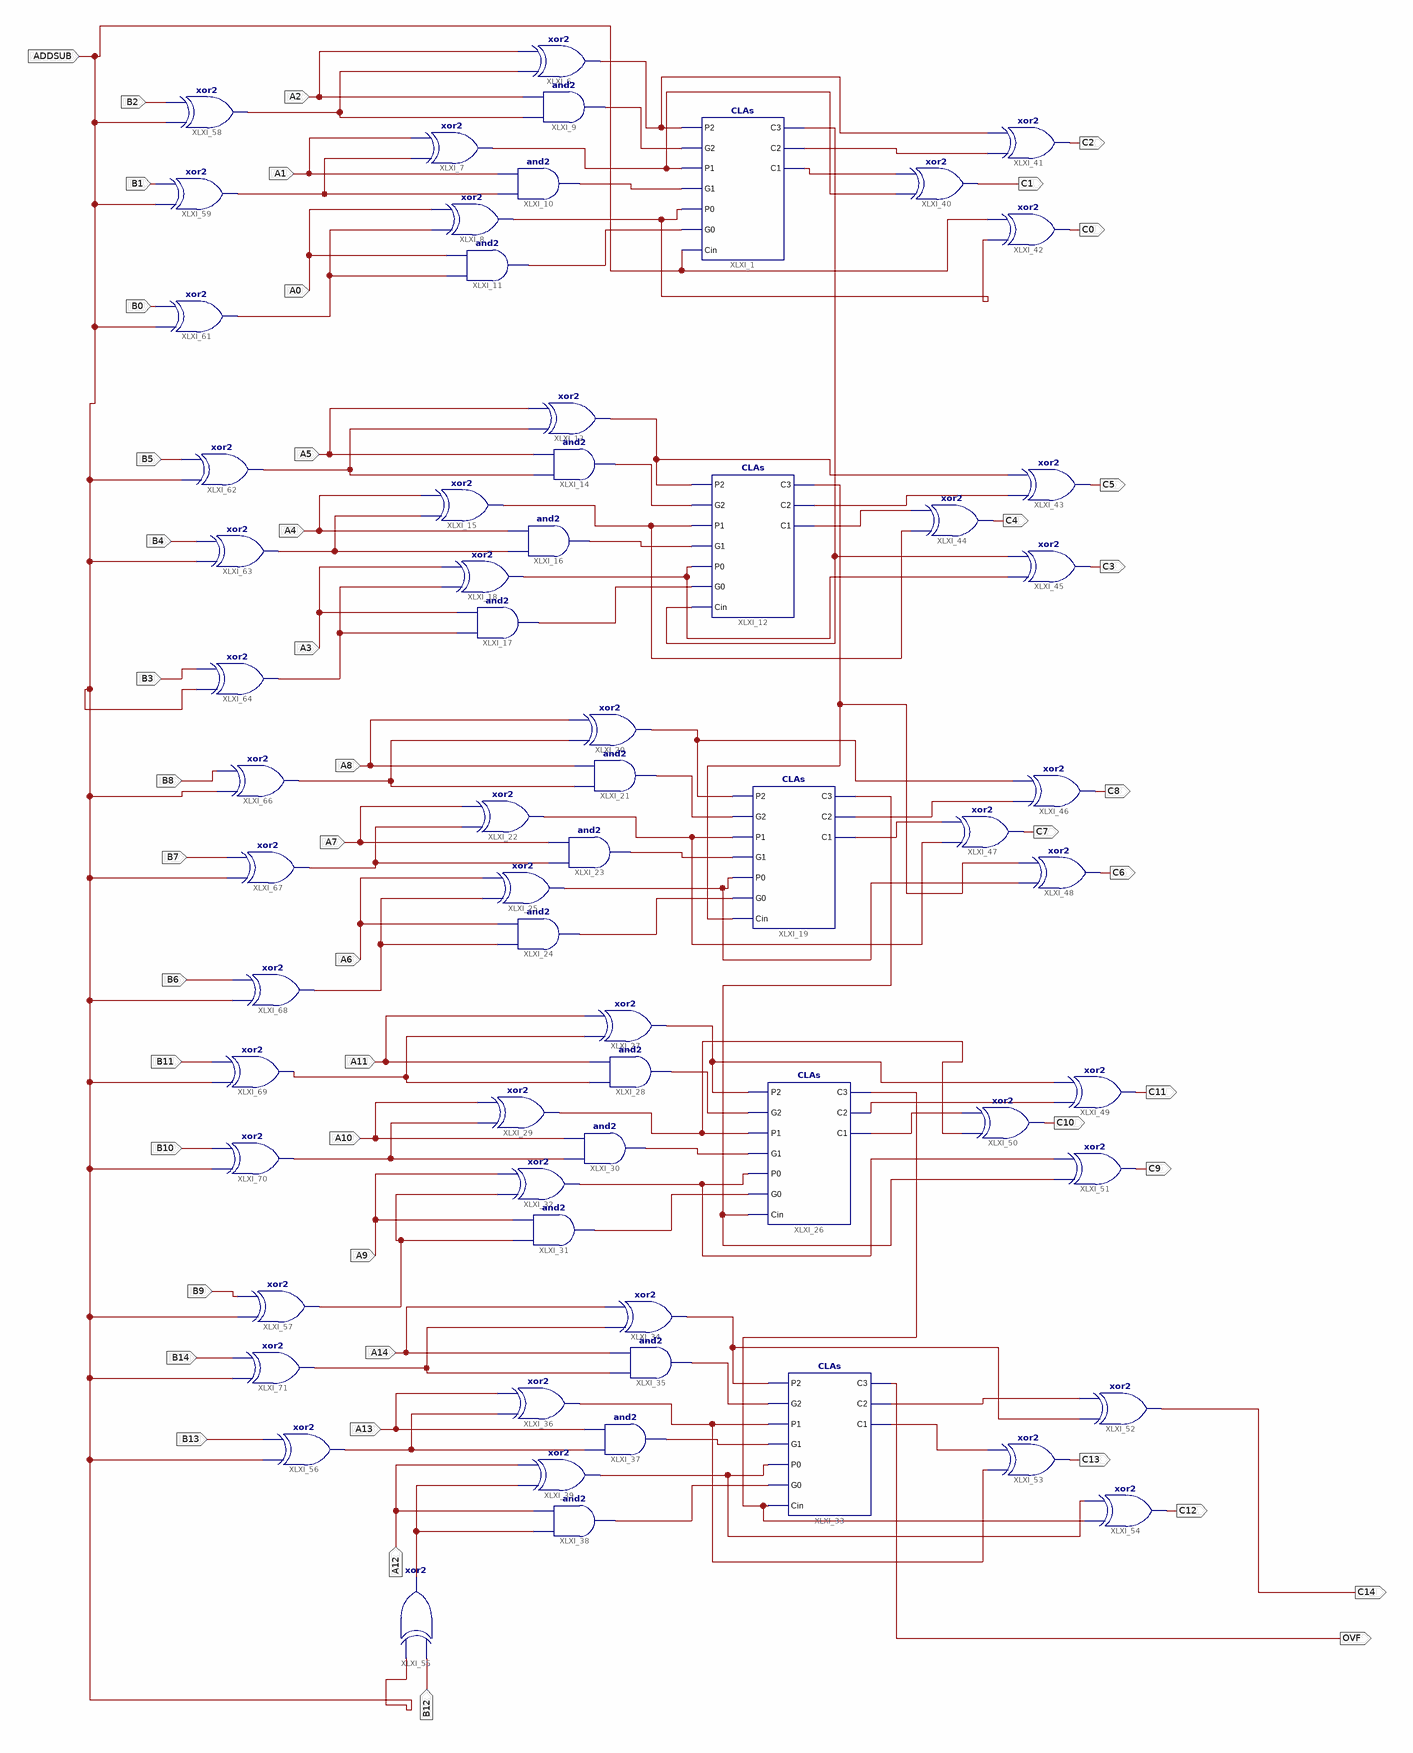
[diagram p0: schematic sheet 1]
// Xilinx ISE schematic CLAsche.sch (spartan3e) as structural Verilog: 65 symbols, 47 ports
module CLAsche (
  input  A2,
  input  B2,
  input  A1,
  input  B1,
  input  A0,
  input  B0,
  input  ADDSUB,
  input  A5,
  input  B5,
  input  A4,
  input  B4,
  input  A3,
  input  B3,
  input  A8,
  input  B8,
  input  A7,
  input  B7,
  input  A6,
  input  B6,
  input  A11,
  input  B11,
  input  A10,
  input  B10,
  input  A9,
  input  B9,
  input  A14,
  input  B14,
  input  A13,
  input  B13,
  input  A12,
  input  B12,
  output OVF,
  output C2,
  output C1,
  output C0,
  output C5,
  output C4,
  output C3,
  output C8,
  output C7,
  output C6,
  output C11,
  output C10,
  output C9,
  output C14,
  output C13,
  output C12
);

  wire XLXN_10, XLXN_11, XLXN_14, XLXN_18, XLXN_26, XLXN_27, XLXN_31, XLXN_34, XLXN_35, XLXN_43, XLXN_44,
       XLXN_48, XLXN_51, XLXN_52, XLXN_60, XLXN_61, XLXN_65, XLXN_66, XLXN_68, XLXN_69, XLXN_72, XLXN_74,
       XLXN_79, XLXN_80, XLXN_84, XLXN_88, XLXN_90, XLXN_94, XLXN_110, XLXN_111, XLXN_112, XLXN_113,
       XLXN_114, XLXN_115, XLXN_117, XLXN_118, XLXN_119, XLXN_120, XLXN_121, XLXN_122, XLXN_124, XLXN_125,
       XLXN_126, XLXN_128, XLXN_129, XLXN_147, XLXN_163, XLXN_164, XLXN_165, XLXN_166, XLXN_167, XLXN_168,
       XLXN_169, XLXN_170, XLXN_171, XLXN_172, XLXN_173, XLXN_174, XLXN_175;

  CLAs XLXI_1 (
    .C1(XLXN_112), .C2(XLXN_113), .C3(XLXN_94), .Cin(ADDSUB), .G0(XLXN_18), .G1(XLXN_14), .G2(XLXN_10),
    .P0(XLXN_110), .P1(XLXN_111), .P2(XLXN_11));
  xor XLXI_6 (XLXN_11, XLXN_163, A2);
  xor XLXI_7 (XLXN_111, XLXN_164, A1);
  xor XLXI_8 (XLXN_110, XLXN_165, A0);
  and XLXI_9 (XLXN_10, XLXN_163, A2);
  and XLXI_10 (XLXN_14, XLXN_164, A1);
  and XLXI_11 (XLXN_18, XLXN_165, A0);
  CLAs XLXI_12 (
    .C1(XLXN_115), .C2(XLXN_114), .C3(XLXN_74), .Cin(XLXN_94), .G0(XLXN_35), .G1(XLXN_31), .G2(XLXN_26),
    .P0(XLXN_34), .P1(XLXN_117), .P2(XLXN_27));
  xor XLXI_13 (XLXN_27, XLXN_166, A5);
  and XLXI_14 (XLXN_26, XLXN_166, A5);
  xor XLXI_15 (XLXN_117, XLXN_167, A4);
  and XLXI_16 (XLXN_31, XLXN_167, A4);
  and XLXI_17 (XLXN_35, XLXN_168, A3);
  xor XLXI_18 (XLXN_34, XLXN_168, A3);
  CLAs XLXI_19 (
    .C1(XLXN_119), .C2(XLXN_118), .C3(XLXN_72), .Cin(XLXN_74), .G0(XLXN_52), .G1(XLXN_48), .G2(XLXN_43),
    .P0(XLXN_51), .P1(XLXN_120), .P2(XLXN_44));
  xor XLXI_20 (XLXN_44, XLXN_169, A8);
  and XLXI_21 (XLXN_43, XLXN_169, A8);
  xor XLXI_22 (XLXN_120, XLXN_170, A7);
  and XLXI_23 (XLXN_48, XLXN_170, A7);
  and XLXI_24 (XLXN_52, XLXN_171, A6);
  xor XLXI_25 (XLXN_51, XLXN_171, A6);
  CLAs XLXI_26 (
    .C1(XLXN_122), .C2(XLXN_121), .C3(XLXN_126), .Cin(XLXN_72), .G0(XLXN_69), .G1(XLXN_65), .G2(XLXN_60),
    .P0(XLXN_68), .P1(XLXN_66), .P2(XLXN_61));
  xor XLXI_27 (XLXN_61, XLXN_172, A11);
  and XLXI_28 (XLXN_60, XLXN_172, A11);
  xor XLXI_29 (XLXN_66, XLXN_173, A10);
  and XLXI_30 (XLXN_65, XLXN_173, A10);
  and XLXI_31 (XLXN_69, XLXN_174, A9);
  xor XLXI_32 (XLXN_68, XLXN_174, A9);
  CLAs XLXI_33 (
    .C1(XLXN_125), .C2(XLXN_124), .C3(OVF), .Cin(XLXN_126), .G0(XLXN_88), .G1(XLXN_84), .G2(XLXN_79),
    .P0(XLXN_128), .P1(XLXN_129), .P2(XLXN_80));
  xor XLXI_34 (XLXN_80, XLXN_175, A14);
  and XLXI_35 (XLXN_79, XLXN_175, A14);
  xor XLXI_36 (XLXN_129, XLXN_147, A13);
  and XLXI_37 (XLXN_84, XLXN_147, A13);
  and XLXI_38 (XLXN_88, XLXN_90, A12);
  xor XLXI_39 (XLXN_128, XLXN_90, A12);
  xor XLXI_40 (C1, XLXN_111, XLXN_112);
  xor XLXI_41 (C2, XLXN_113, XLXN_11);
  xor XLXI_42 (C0, XLXN_110, ADDSUB);
  xor XLXI_43 (C5, XLXN_114, XLXN_27);
  xor XLXI_44 (C4, XLXN_117, XLXN_115);
  xor XLXI_45 (C3, XLXN_34, XLXN_94);
  xor XLXI_46 (C8, XLXN_118, XLXN_44);
  xor XLXI_47 (C7, XLXN_120, XLXN_119);
  xor XLXI_48 (C6, XLXN_51, XLXN_74);
  xor XLXI_49 (C11, XLXN_121, XLXN_61);
  xor XLXI_50 (C10, XLXN_66, XLXN_122);
  xor XLXI_51 (C9, XLXN_72, XLXN_68);
  xor XLXI_52 (C14, XLXN_80, XLXN_124);
  xor XLXI_53 (C13, XLXN_129, XLXN_125);
  xor XLXI_54 (C12, XLXN_126, XLXN_128);
  xor XLXI_55 (XLXN_90, B12, ADDSUB);
  xor XLXI_56 (XLXN_147, ADDSUB, B13);
  xor XLXI_57 (XLXN_174, ADDSUB, B9);
  xor XLXI_58 (XLXN_163, ADDSUB, B2);
  xor XLXI_59 (XLXN_164, ADDSUB, B1);
  xor XLXI_61 (XLXN_165, ADDSUB, B0);
  xor XLXI_62 (XLXN_166, ADDSUB, B5);
  xor XLXI_63 (XLXN_167, ADDSUB, B4);
  xor XLXI_64 (XLXN_168, ADDSUB, B3);
  xor XLXI_66 (XLXN_169, ADDSUB, B8);
  xor XLXI_67 (XLXN_170, ADDSUB, B7);
  xor XLXI_68 (XLXN_171, ADDSUB, B6);
  xor XLXI_69 (XLXN_172, ADDSUB, B11);
  xor XLXI_70 (XLXN_173, ADDSUB, B10);
  xor XLXI_71 (XLXN_175, ADDSUB, B14);
endmodule
